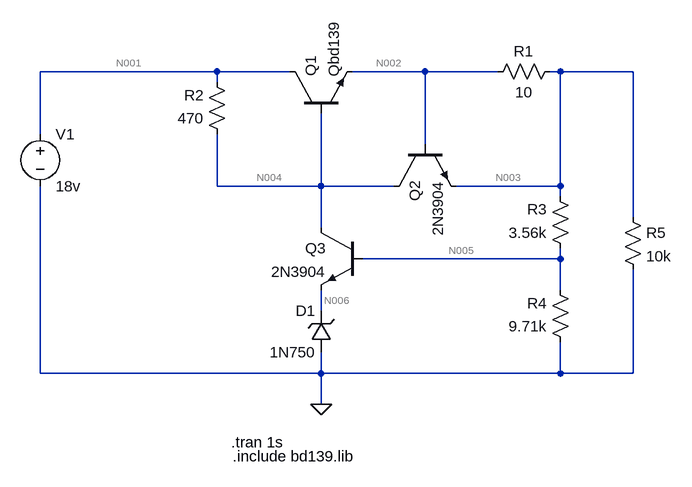
[diagram p0: schematic Transistor Series Voltage Regulator.asc]
Transistor Series Voltage Regulator.asc, the LTspice schematic file:
Version 4
SHEET 1 880 680
WIRE -176 -128 -448 -128
WIRE -64 -128 -176 -128
WIRE 144 -128 32 -128
WIRE 256 -128 144 -128
WIRE 352 -128 336 -128
WIRE 464 -128 352 -128
WIRE -176 -112 -176 -128
WIRE -448 -32 -448 -128
WIRE 144 -16 144 -128
WIRE -176 48 -176 -32
WIRE -16 48 -16 -64
WIRE -16 48 -176 48
WIRE 96 48 -16 48
WIRE 352 48 352 -128
WIRE 352 48 192 48
WIRE 352 64 352 48
WIRE 464 96 464 -128
WIRE -16 112 -16 48
WIRE 352 160 352 144
WIRE 352 160 48 160
WIRE 352 208 352 160
WIRE -16 240 -16 208
WIRE -448 336 -448 48
WIRE -16 336 -16 304
WIRE -16 336 -448 336
WIRE 352 336 352 288
WIRE 352 336 -16 336
WIRE 464 336 464 176
WIRE 464 336 352 336
WIRE -16 384 -16 336
FLAG -16 384 0
SYMBOL npn -64 -64 R270
SYMATTR InstName Q1
SYMATTR Value Qbd139
SYMBOL npn 96 -16 M90
SYMATTR InstName Q2
SYMATTR Value 2N3904
SYMBOL npn 48 112 M0
SYMATTR InstName Q3
SYMATTR Value 2N3904
SYMBOL zener 0 304 R180
WINDOW 0 24 64 Left 2
WINDOW 3 24 0 Left 2
SYMATTR InstName D1
SYMATTR Value 1N750
SYMBOL res 352 -144 R90
WINDOW 0 0 56 VBottom 2
WINDOW 3 32 56 VTop 2
SYMATTR InstName R1
SYMATTR Value 10
SYMBOL res -160 -16 R180
WINDOW 0 36 76 Left 2
WINDOW 3 36 40 Left 2
SYMATTR InstName R2
SYMATTR Value 470
SYMBOL res 368 160 R180
WINDOW 0 36 76 Left 2
WINDOW 3 36 40 Left 2
SYMATTR InstName R3
SYMATTR Value 3.56k
SYMBOL res 368 304 R180
WINDOW 0 36 76 Left 2
WINDOW 3 36 40 Left 2
SYMATTR InstName R4
SYMATTR Value 9.71k
SYMBOL voltage -448 -48 R0
WINDOW 123 0 0 Left 0
WINDOW 39 0 0 Left 0
SYMATTR InstName V1
SYMATTR Value 18v
SYMBOL res 448 80 R0
SYMATTR InstName R5
SYMATTR Value 10k
TEXT -152 464 Left 2 !.include bd139.lib
TEXT -154 442 Left 2 !.tran 1s

The netlist it stands for:
* Transistor Series Voltage Regulator.asc
Q1 N001 N004 N002 0 Qbd139
Q2 N004 N002 N003 0 2N3904
Q3 N004 N005 N006 0 2N3904
D1 0 N006 1N750
R1 N003 N002 10
R2 N004 N001 470
R3 N005 N003 3.56k
R4 0 N005 9.71k
V1 N001 0 18v
R5 N003 0 10k
.model D D
.lib standard.dio
.model NPN NPN
.model PNP PNP
.lib standard.bjt
.include bd139.lib
.tran 1s
.backanno
.end

* Results of the author's LTspice run, read from the files saved beside the schematic
* Operating Point, zero values left out:
*   V(n001) = 18 V
*   V(n004) = 8.015 V
*   V(n002) = 7.709 V
*   V(n003) = 7.695 V
*   V(n005) = 5.442 V
*   V(n006) = 4.703 V
*   Ic(Q1) = 1.38 mA
*   Ib(Q1) = 22.03 µA
*   Ie(Q1) = -1.402 mA
*   Ic(Q3) = 21.22 mA
*   Ib(Q3) = 72.53 µA
*   Ie(Q3) = -21.29 mA
*   I(D1) = -21.29 mA
*   I(R1) = -1.402 mA
*   I(R2) = -21.24 mA
*   I(R3) = -633 µA
*   I(R4) = -560.4 µA
*   I(R5) = 769.5 µA
*   I(V1) = -22.62 mA